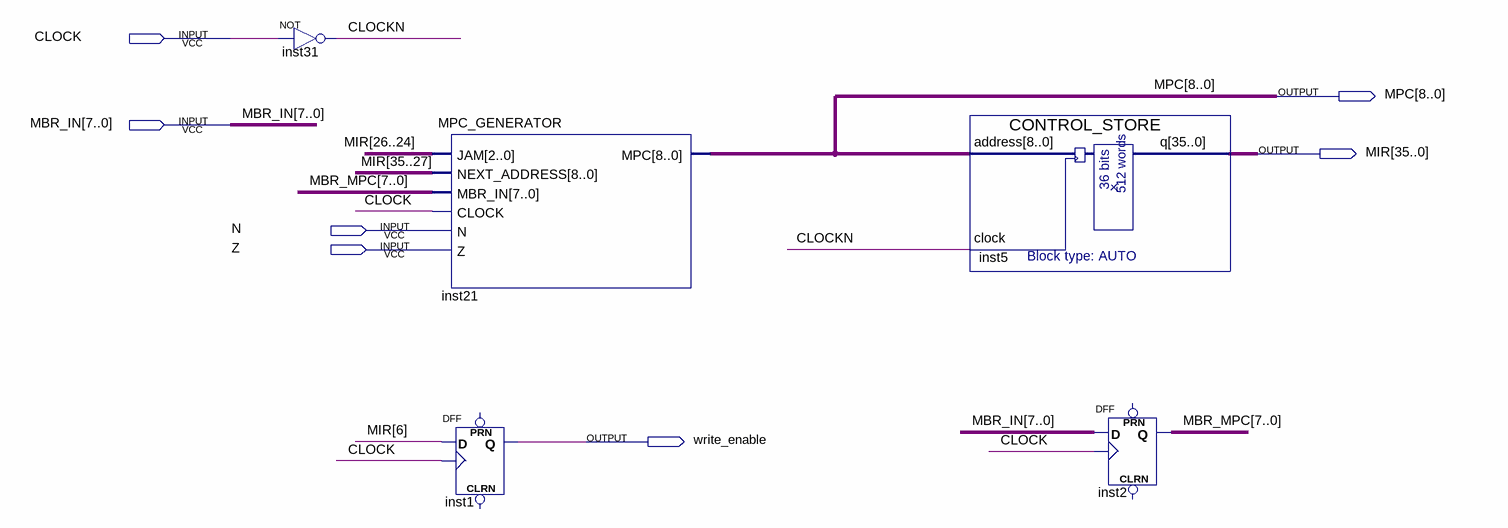
[diagram p0: schematic sheet]
// Quartus schematic CONTROL_UNIT.bdf as structural Verilog: 5 symbols, 7 pins
module CONTROL_UNIT (
  input  CLOCK,
  input  [7:0] MBR_IN,
  input  N,
  input  Z,
  output [8:0] MPC,
  output [35:0] MIR,
  output write_enable
);

  wire CLOCKN;
  wire [7:0] MBR_MPC;

  not inst31 (CLOCKN, CLOCK);
  MPC_GENERATOR inst21 (
    .JAM(MIR[26:24]), .NEXT_ADDRESS(MIR[35:27]), .MBR_IN(MBR_MPC), .CLOCK(CLOCK), .N(N), .Z(Z), .MPC(MPC));
  DFF inst1 (.CLK(CLOCK), .D(MIR[6]), .Q(write_enable));  // open: CLRN, PRN
  CONTROL_STORE inst5 (.address(MPC), .clock(CLOCKN), .q(MIR));
  DFF inst2[7:0] (.CLK(CLOCK), .D(MBR_IN), .Q(MBR_MPC));  // open: CLRN, PRN
endmodule
